# EAGLE schematic motorMonitoringSytem (EAGLE 9.6.2)

## Sheet 1 of 2
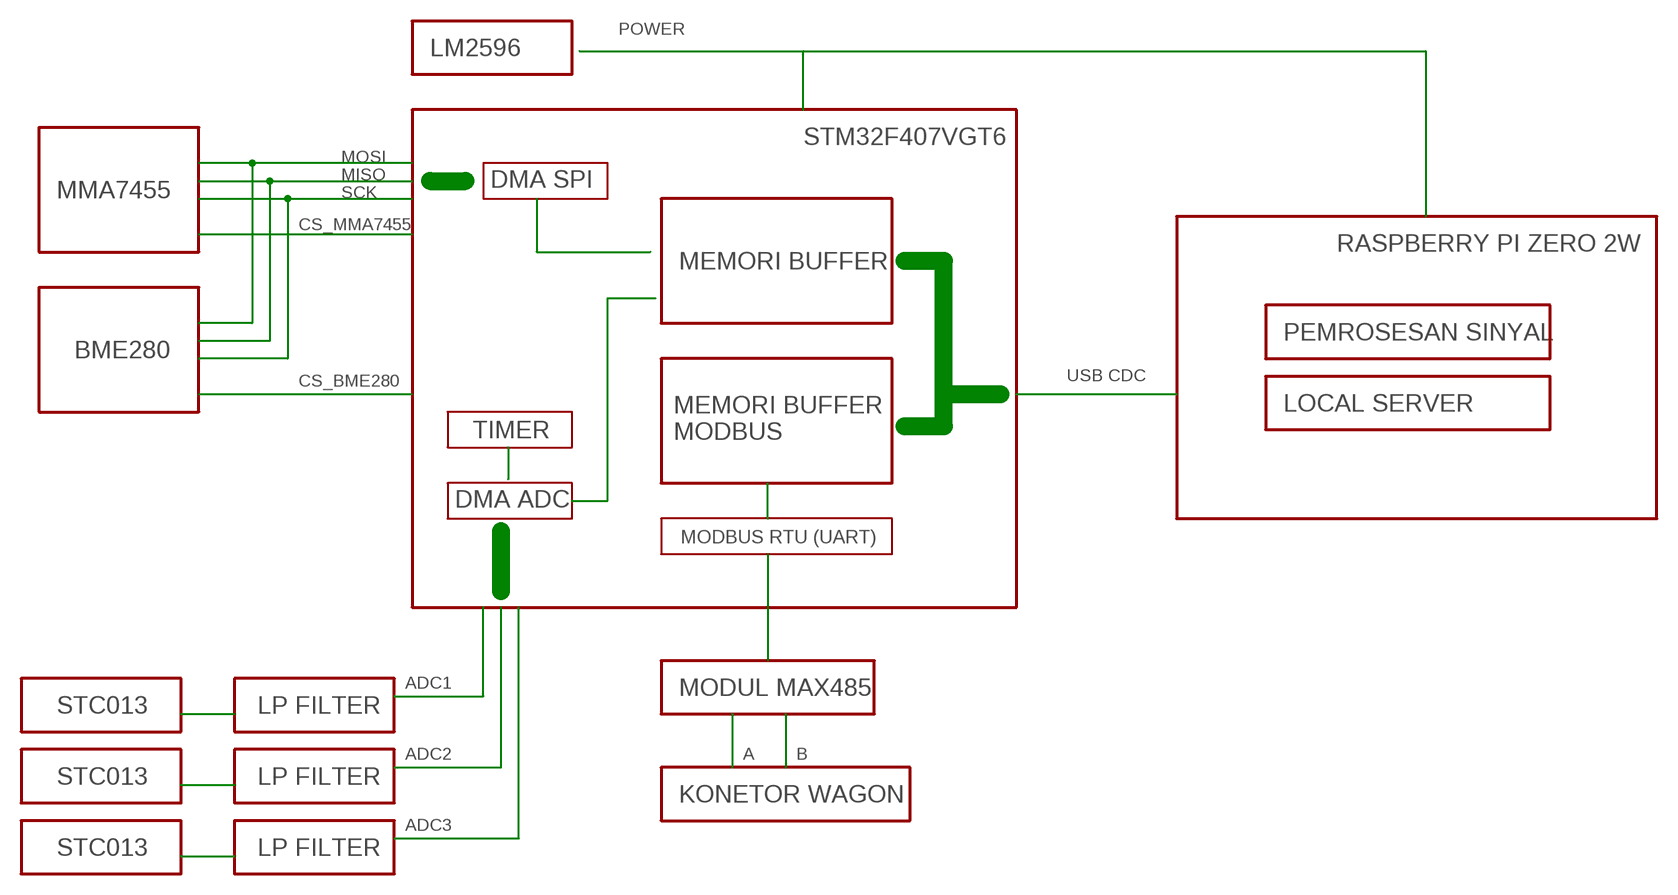
[diagram p0: schematic, sheet 1]

### Notes on the sheet
- POWER
- LM2596
- STM32F407VGT6
- MOSI
- MISO
- DMA SPI
- MMA7455 | SCK
- CS_MMA7455
- RASPBERRY PI ZERO 2W
- MEMORI BUFFER
- PEMROSESAN SINYAL
- BME280
- USB CDC
- CS_BME280
- LOCAL SERVER
- TIMER
- MEMORI BUFFER
  MODBUS
- DMA ADC
- MODBUS RTU (UART)
- ADC1
- MODUL MAX485
- STC013 | LP FILTER
- ADC2 | A | B
- STC013 | LP FILTER
- KONETOR WAGON
- ADC3
- STC013 | LP FILTER

## Sheet 2 of 2
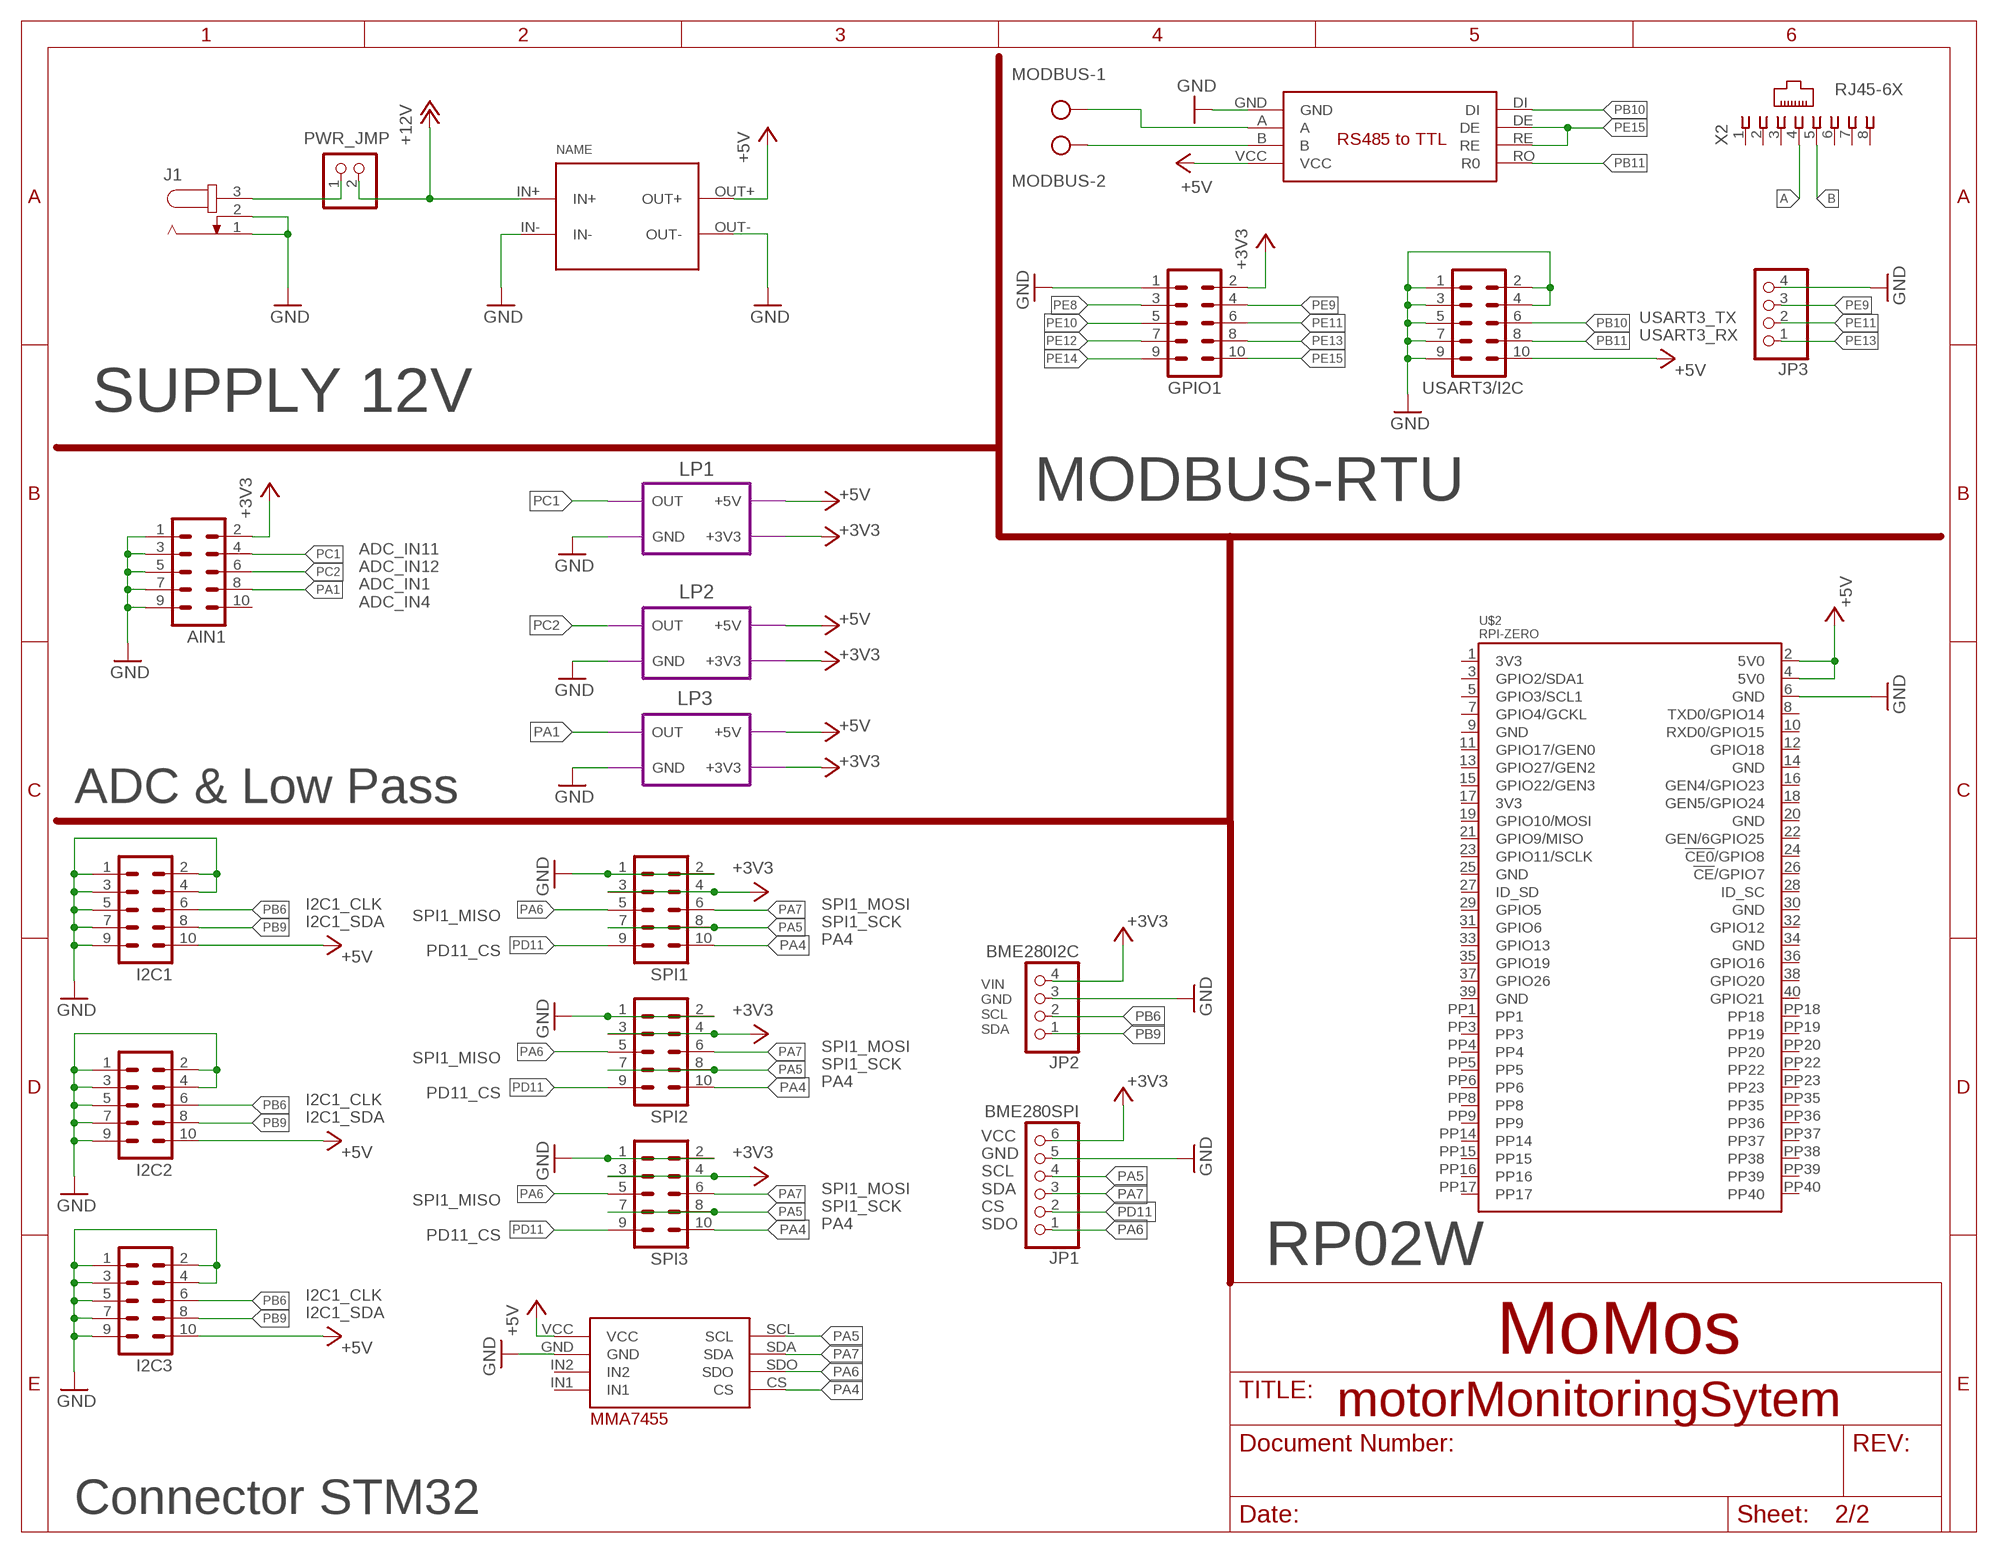
[diagram p1: schematic, sheet 2]
FRAME1 (FRAME_A_L): MOMOS: MoMos

### Parts
AIN1  ML10  [ML10]
GPIO1  ML10  [ML10]
I2C1  ML10  [ML10]
I2C2  ML10  [ML10]
I2C3  ML10  [ML10]
J1  JACK-PLUG0  [SPC4077]
JP1  BME280SPI  PINHD-1X6  [1X06]
JP2  BME280I2C  PINHD-1X4  [1X04]
JP3  PINHD-1X4  [1X04]
MODBUS  W237-102  [W237-102]
PWR_JMP  PINHD-1X2  [1X02]
RS485-2-TTL1  RS485-2-TTL  [RS485-2-TTL]
SPI1  ML10  [ML10]
SPI2  ML10  [ML10]
SPI3  ML10  [ML10]
U$1  CP8-ADJ  [CP8-ADJ]
U$2  RPI-ZERO  [RASP_PI_ZERO_BOARD_FULL]
U$3  MMA7455-MODULE  [MMA7455-MOD-FOOT]
USART3/I2C  ML10  [ML10]
X2  RJ45-6X  [RJ45-NO-SHIELD]

### Module instances
LP1 = LP_KRC
LP2 = LP_KRC
LP3 = LP_KRC

### Nets
+3V3: AIN1.2 GPIO1.2 JP1.6 JP2.4 SPI1.3 SPI1.4 SPI2.3 SPI2.4 SPI3.3 SPI3.4 ; port LP1.+3V3 LP2.+3V3 LP3.+3V3
+5V: I2C1.10 I2C2.10 I2C3.10 RS485-2-TTL1.VCC U$1.OUT+ U$2.2(5V0) U$2.4(5V0) U$3.VCC USART3/I2C.10 ; port LP1.+5V LP2.+5V LP3.+5V
+12V: PWR_JMP.2 U$1.IN+
A: MODBUS.1 RS485-2-TTL1.A X2.4
B: MODBUS.2 RS485-2-TTL1.B X2.5
GND: AIN1.1 AIN1.3 AIN1.5 AIN1.7 AIN1.9 GPIO1.1 I2C1.1 I2C1.2 I2C1.3 I2C1.4 I2C1.5 I2C1.7 I2C1.9 I2C2.1 I2C2.2 I2C2.3 I2C2.4 I2C2.5 I2C2.7 I2C2.9 I2C3.1 I2C3.2 I2C3.3 I2C3.4 I2C3.5 I2C3.7 I2C3.9 J1.1 J1.2 JP1.5 JP2.3 JP3.4 RS485-2-TTL1.GND SPI1.1 SPI1.2 SPI2.1 SPI2.2 SPI3.1 SPI3.2 U$1.IN- U$1.OUT- U$2.6(GND) U$3.GND USART3/I2C.1 USART3/I2C.2 USART3/I2C.3 USART3/I2C.4 USART3/I2C.5 USART3/I2C.7 USART3/I2C.9 ; port LP1.GND LP2.GND LP3.GND
N$1: J1.3 PWR_JMP.1
PA1: AIN1.8 ; port LP3.OUT
PA4: SPI1.10 SPI2.10 SPI3.10 U$3.CS
PA5: JP1.4 SPI1.7 SPI1.8 SPI2.7 SPI2.8 SPI3.7 SPI3.8 U$3.SCL
PA6: JP1.1 SPI1.5 SPI2.5 SPI3.5 U$3.SDO
PA7: JP1.3 SPI1.6 SPI2.6 SPI3.6 U$3.SDA
PB6: I2C1.6 I2C2.6 I2C3.6 JP2.2
PB9: I2C1.8 I2C2.8 I2C3.8 JP2.1
PB10: RS485-2-TTL1.DI USART3/I2C.6
PB11: RS485-2-TTL1.RO(R0) USART3/I2C.8
PC1: AIN1.4 ; port LP1.OUT
PC2: AIN1.6 ; port LP2.OUT
PD11: JP1.2 SPI1.9 SPI2.9 SPI3.9
PE8: GPIO1.3
PE9: GPIO1.4 JP3.3
PE10: GPIO1.5
PE11: GPIO1.6 JP3.2
PE12: GPIO1.7
PE13: GPIO1.8 JP3.1
PE14: GPIO1.9
PE15: GPIO1.10 RS485-2-TTL1.DE RS485-2-TTL1.RE
Unconnected: AIN1.10 U$2.1(3V3) U$2.3(GPIO2/SDA1) U$2.5(GPIO3/SCL1) U$2.7(GPIO4/GCKL) U$2.8(TXD0/GPIO14) U$2.9(GND) U$2.10(RXD0/GPIO15) U$2.11(GPIO17/GEN0) U$2.12(GPIO18) U$2.13(GPIO27/GEN2) U$2.14(GND) U$2.15(GPIO22/GEN3) U$2.16(GEN4/GPIO23) U$2.17(3V3) U$2.18(GEN5/GPIO24) U$2.19(GPIO10/MOSI) U$2.20(GND) U$2.21(GPIO9/MISO) U$2.22(GEN/6GPIO25) U$2.23(GPIO11/SCLK) U$2.24(!CE0!/GPIO8) U$2.25(GND) U$2.26(!CE!/GPIO7) U$2.27(ID_SD) U$2.28(ID_SC) U$2.29(GPIO5) U$2.30(GND) U$2.31(GPIO6) U$2.32(GPIO12) U$2.33(GPIO13) U$2.34(GND) U$2.35(GPIO19) U$2.36(GPIO16) U$2.37(GPIO26) U$2.38(GPIO20) U$2.39(GND) U$2.40(GPIO21) U$2.PP1 U$2.PP3 U$2.PP4 U$2.PP5 U$2.PP6 U$2.PP8 U$2.PP9 U$2.PP14 U$2.PP15 U$2.PP16 U$2.PP17 U$2.PP18 U$2.PP19 U$2.PP20 U$2.PP22 U$2.PP23 U$2.PP35 U$2.PP36 U$2.PP37 U$2.PP38 U$2.PP39 U$2.PP40 U$3.IN1 U$3.IN2 X2.1 X2.2 X2.3 X2.6 X2.7 X2.8

### Notes on the sheet
- USART3_TX
  USART3_RX
- SUPPLY 12V
- MODBUS-RTU
- ADC_IN11
  ADC_IN12
  ADC_IN1
  ADC_IN4
- ADC & Low Pass
- SPI1_MISO
  
  PD11_CS
- I2C1_CLK
  I2C1_SDA
- SPI1_MOSI
  SPI1_SCK
  PA4
- VIN
  GND
  SCL
  SDA
- SPI1_MISO
  
  PD11_CS
- SPI1_MOSI
  SPI1_SCK
  PA4
- I2C1_CLK
  I2C1_SDA
- SPI1_MISO
  
  PD11_CS
- SPI1_MOSI
  SPI1_SCK
  PA4
- VCC
  GND
  SCL
  SDA
  CS
  SDO
- RP02W
- I2C1_CLK
  I2C1_SDA
- Connector STM32

## Library data of the parts
AIN1 GPIO1 I2C1-I2C3 SPI1-SPI3 USART3/I2C = con-ml:ML10: HARTING; OC_FARNELL: unknown; OC_NEWARK: unknown
J1 = con-jack:JACK-PLUG: DC POWER JACK Power Jack, DC, Right Angle, Through Hole, Rated 5A at 16VDC, PC Terminals Distributor: Farnell (www.Farnell.de) Drawing: 84N1161.pdf / 84N1162.pdf Manufacturer: SPC Technology (www.spctechnology.com) Type: SPC4077 / SPC 4078; OC_FARNELL: unknown; OC_NEWARK: unknown
JP1 = pinhead:PINHD-1X6: PIN HEADER
JP2 JP3 = pinhead:PINHD-1X4: PIN HEADER
MODBUS = con-wago-500:W237-102: WAGO SCREW CLAMP; MPN: 237-102; OC_FARNELL: unknown; OC_NEWARK: 70K9898
PWR_JMP = pinhead:PINHD-1X2: PIN HEADER
RS485-2-TTL1 = userlib:RS485-2-TTL
U$1 = userlib:CP8-ADJ: Voltage regulator IN: 7-35V OUT: ADJ
U$2 = rpi-zero:RPI-ZERO
U$3 = userlib:MMA7455-MODULE
X2 = con-tycoelectronics:RJ45: CORCOM Modular RJ Jacks No Shield Source: www.tycoelectronics.com .. ENG_DS_1654001_1099_RJ_L_0507.pdf; MPN: RJ45-6X; OC_FARNELL: unknown; OC_NEWARK: 01P1604

## Module LP_KRC
Ports: OUT(out) +3V3(io) +5V(io) GND(io)
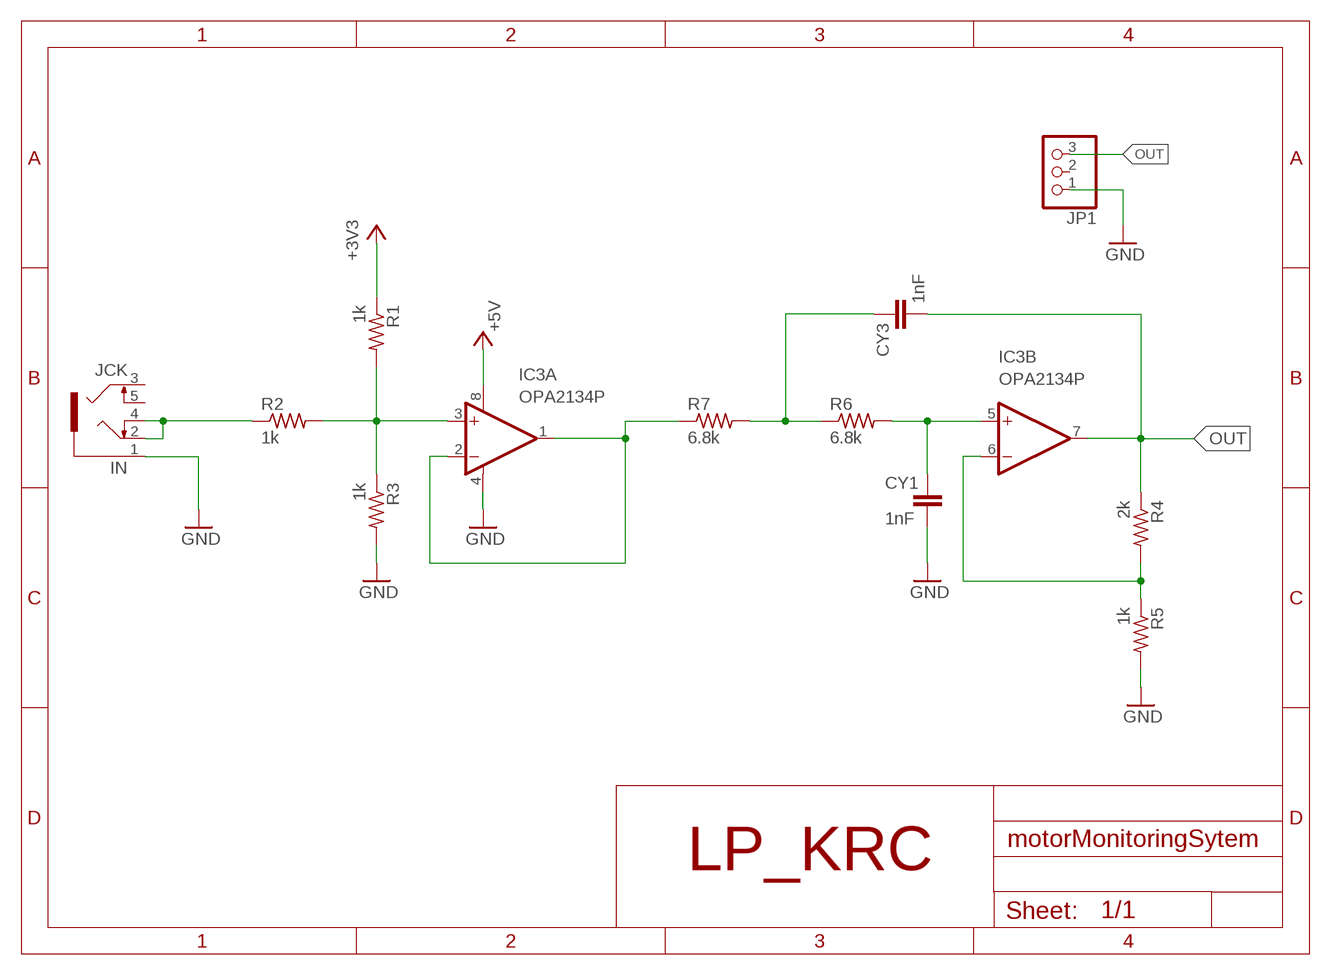
[diagram p2: schematic, module LP_KRC, sheet 1]

### Parts
CY1  1nF  C-EU050-030X075  [C050-030X075]
CY3  1nF  C-EU050-030X075  [C050-030X075]
IC3  OPA2134P  [DIL08]
JCK  IN  1503_09  [1503_09]
JP1  PINHD-1X3  [1X03]
R1  1k  R-US_0207/10  [0207/10]
R2  1k  R-US_0207/10  [0207/10]
R3  1k  R-US_0207/10  [0207/10]
R4  2k  R-US_0207/10  [0207/10]
R5  1k  R-US_0207/10  [0207/10]
R6  6.8k  R-US_0207/10  [0207/10]
R7  6.8k  R-US_0207/10  [0207/10]

### Nets
+3V3: R1.1
+5V: IC3.8(A:V+)
GND: CY1.2 IC3.4(A:V-) JCK.1 JP1.1 R3.2 R5.2
N$1: IC3.3(A:+IN) R1.2 R2.2 R3.1
N$2: IC3.1(A:OUT) IC3.2(A:-IN) R7.1
N$3: IC3.6(B:-IN) R4.2 R5.1
N$4: CY3.1 R6.1 R7.2
N$5: CY1.1 IC3.5(B:+IN) R6.2
N$7: JCK.2 JCK.4 R2.1
OUT: CY3.2 IC3.7(B:OUT) JP1.3 R4.1
Unconnected: JCK.3 JCK.5 JP1.2

### Notes on the sheet
- LP_KRC

### Library data of the parts
CY1 CY3 = rcl2:C-EU: CAPACITOR, European symbol; SPICEPREFIX: C
IC3 = burr-brown:OPA2134: Operational Amplifier; MF: TEXAS INSTRUMENTS; MPN: OPA2134PA; OC_FARNELL: 1097574; OC_NEWARK: 74K3897
JCK = con-lumberg:1503_09: Jack connectors according to JISC 6560, 3.5 mm Klinkeneinbaukupplung nach JISC 6560, 3,5 mm, 3-polig/ stereo, abgewinkelte Ausführung, mit 2 Öffnern und Lötaugen, für Leiterplatten Rückseitenmontage Source: http://www.lumberg.com/Produkte/PDFs/1503_09.pdf; OC_FARNELL: 1243244; OC_NEWARK: unknown
JP1 = pinhead:PINHD-1X3: PIN HEADER
R1-R7 = rcl:R-US_: RESISTOR, American symbol; SPICEPREFIX: R